# EAGLE design solenoid valve2 (EAGLE 9.2.2)

## Sheet 1 of 5: photorelay0
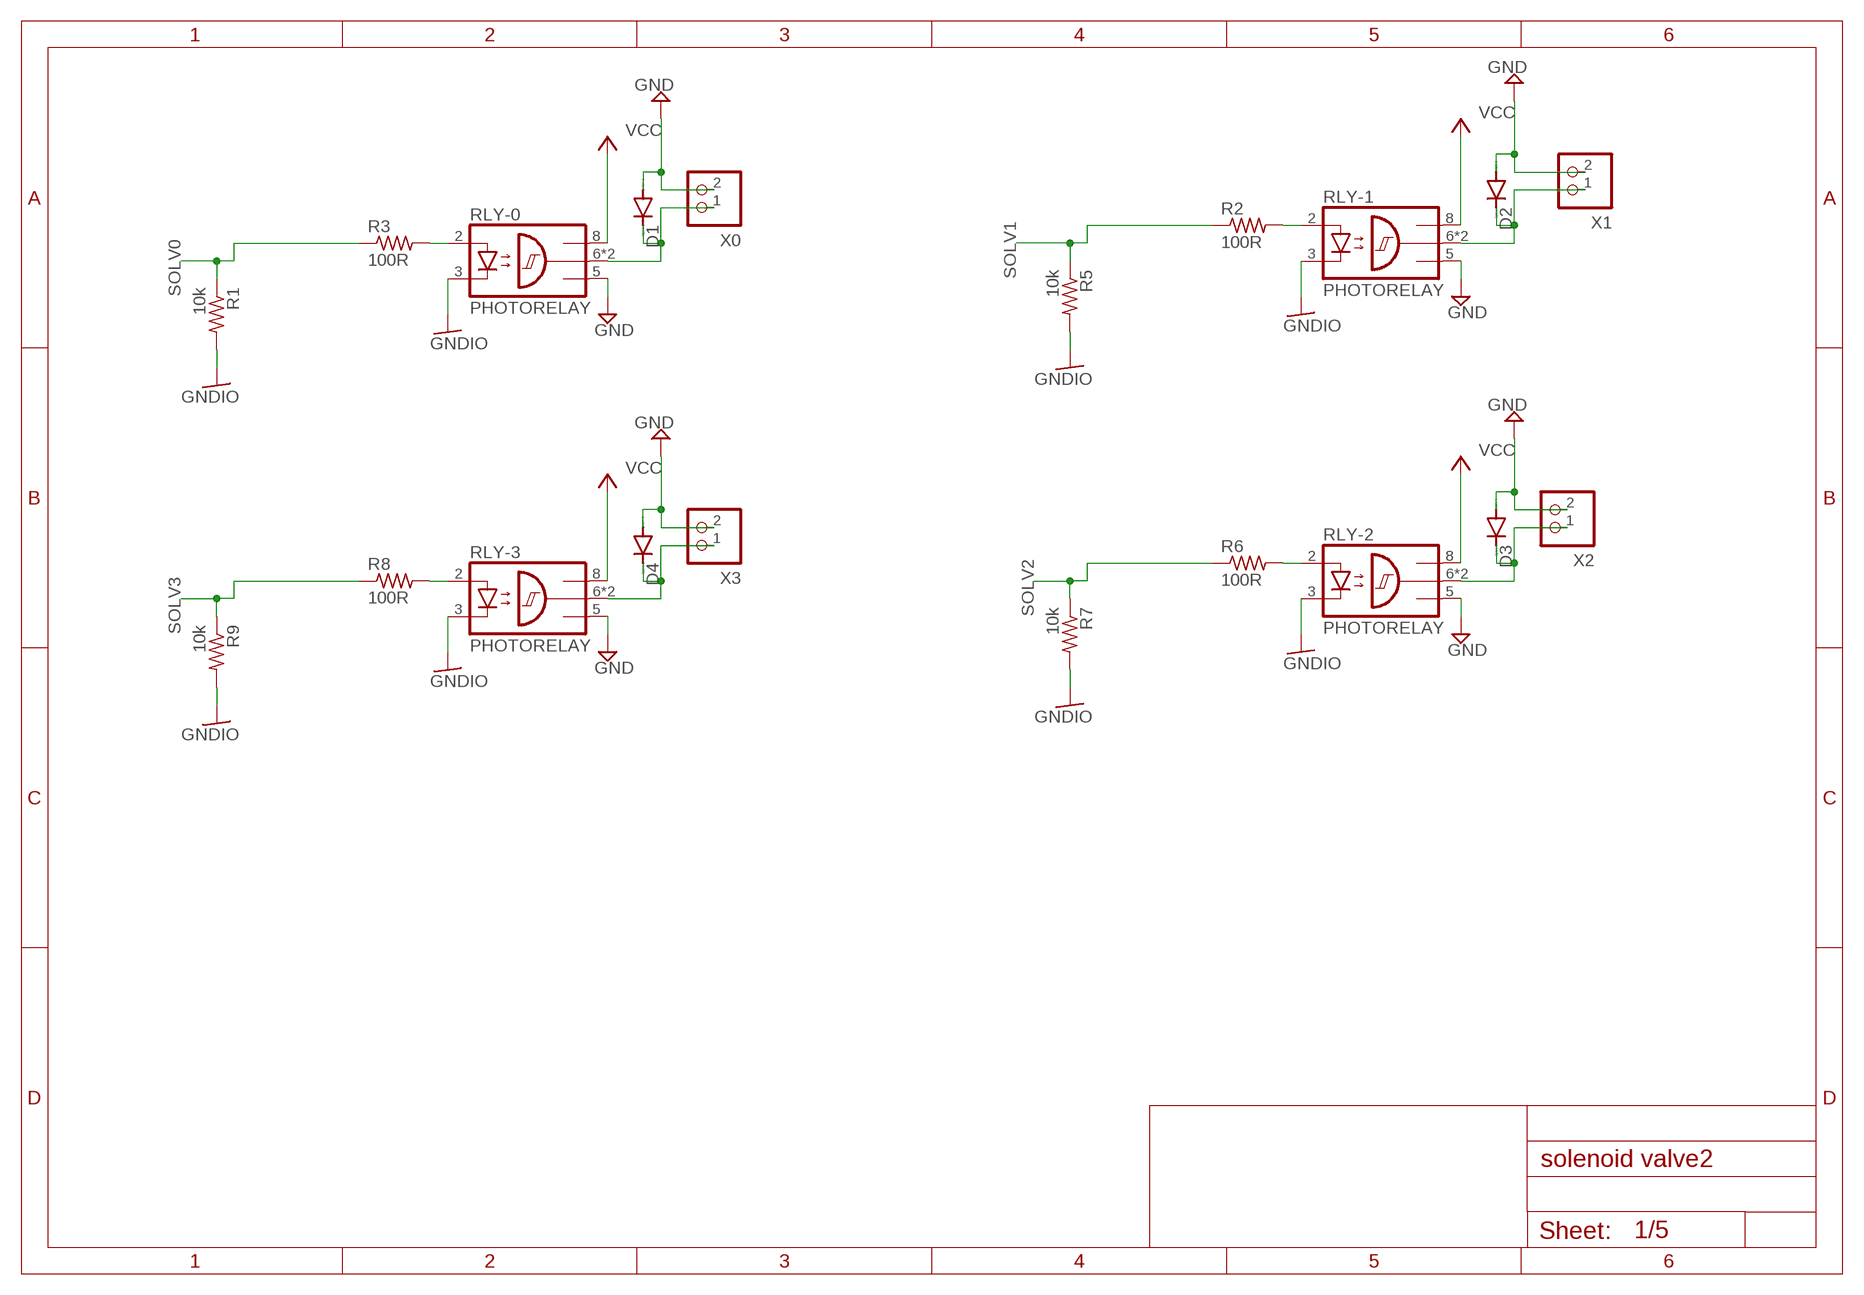
[diagram p0: schematic, sheet 1]

### Parts
D1  DIODE-SOD123  [SOD123]
D2  DIODE-SOD123  [SOD123]
D3  DIODE-SOD123  [SOD123]
D4  DIODE-SOD123  [SOD123]
R1  10k  R-US_R0603  [R0603]
R2  100R  R-US_R0603  [R0603]
R3  100R  R-US_R0603  [R0603]
R5  10k  R-US_R0603  [R0603]
R6  100R  R-US_R0603  [R0603]
R7  10k  R-US_R0603  [R0603]
R8  100R  R-US_R0603  [R0603]
R9  10k  R-US_R0603  [R0603]
RLY-0  PHOTORELAY  [SOP254P1016X385-8]
RLY-1  PHOTORELAY  [SOP254P1016X385-8]
RLY-2  PHOTORELAY  [SOP254P1016X385-8]
RLY-3  PHOTORELAY  [SOP254P1016X385-8]
X0  S2B-XH-A  [S2B-XH-A]
X1  S2B-XH-A  [S2B-XH-A]
X2  S2B-XH-A  [S2B-XH-A]
X3  S2B-XH-A  [S2B-XH-A]

### Nets
GND: D1.A D2.A D3.A D4.A RLY-0.5(GND) RLY-1.5(GND) RLY-2.5(GND) RLY-3.5(GND) X0.2 X1.2 X2.2 X3.2 ; also sheet 2
GNDIO: R1.2 R5.2 R7.2 R9.2 RLY-0.3(C) RLY-1.3(C) RLY-2.3(C) RLY-3.3(C) ; also sheet 2,3,4,5
N$1: D2.C RLY-1.6(OUT) RLY-1.7(OUT) X1.1
N$2: R2.2 RLY-1.2(A)
N$3: D1.C RLY-0.6(OUT) RLY-0.7(OUT) X0.1
N$5: D3.C RLY-2.6(OUT) RLY-2.7(OUT) X2.1
N$6: R3.2 RLY-0.2(A)
N$8: R6.2 RLY-2.2(A)
N$23: D4.C RLY-3.6(OUT) RLY-3.7(OUT) X3.1
N$24: R8.2 RLY-3.2(A)
SOLV0: R1.1 R3.1 ; also sheet 3
SOLV1: R2.1 R5.1 ; also sheet 3
SOLV2: R6.1 R7.1 ; also sheet 3
SOLV3: R8.1 R9.1 ; also sheet 3
VCC: RLY-0.8(VCC) RLY-1.8(VCC) RLY-2.8(VCC) RLY-3.8(VCC) ; also sheet 2

## Sheet 2 of 5: photorelay1
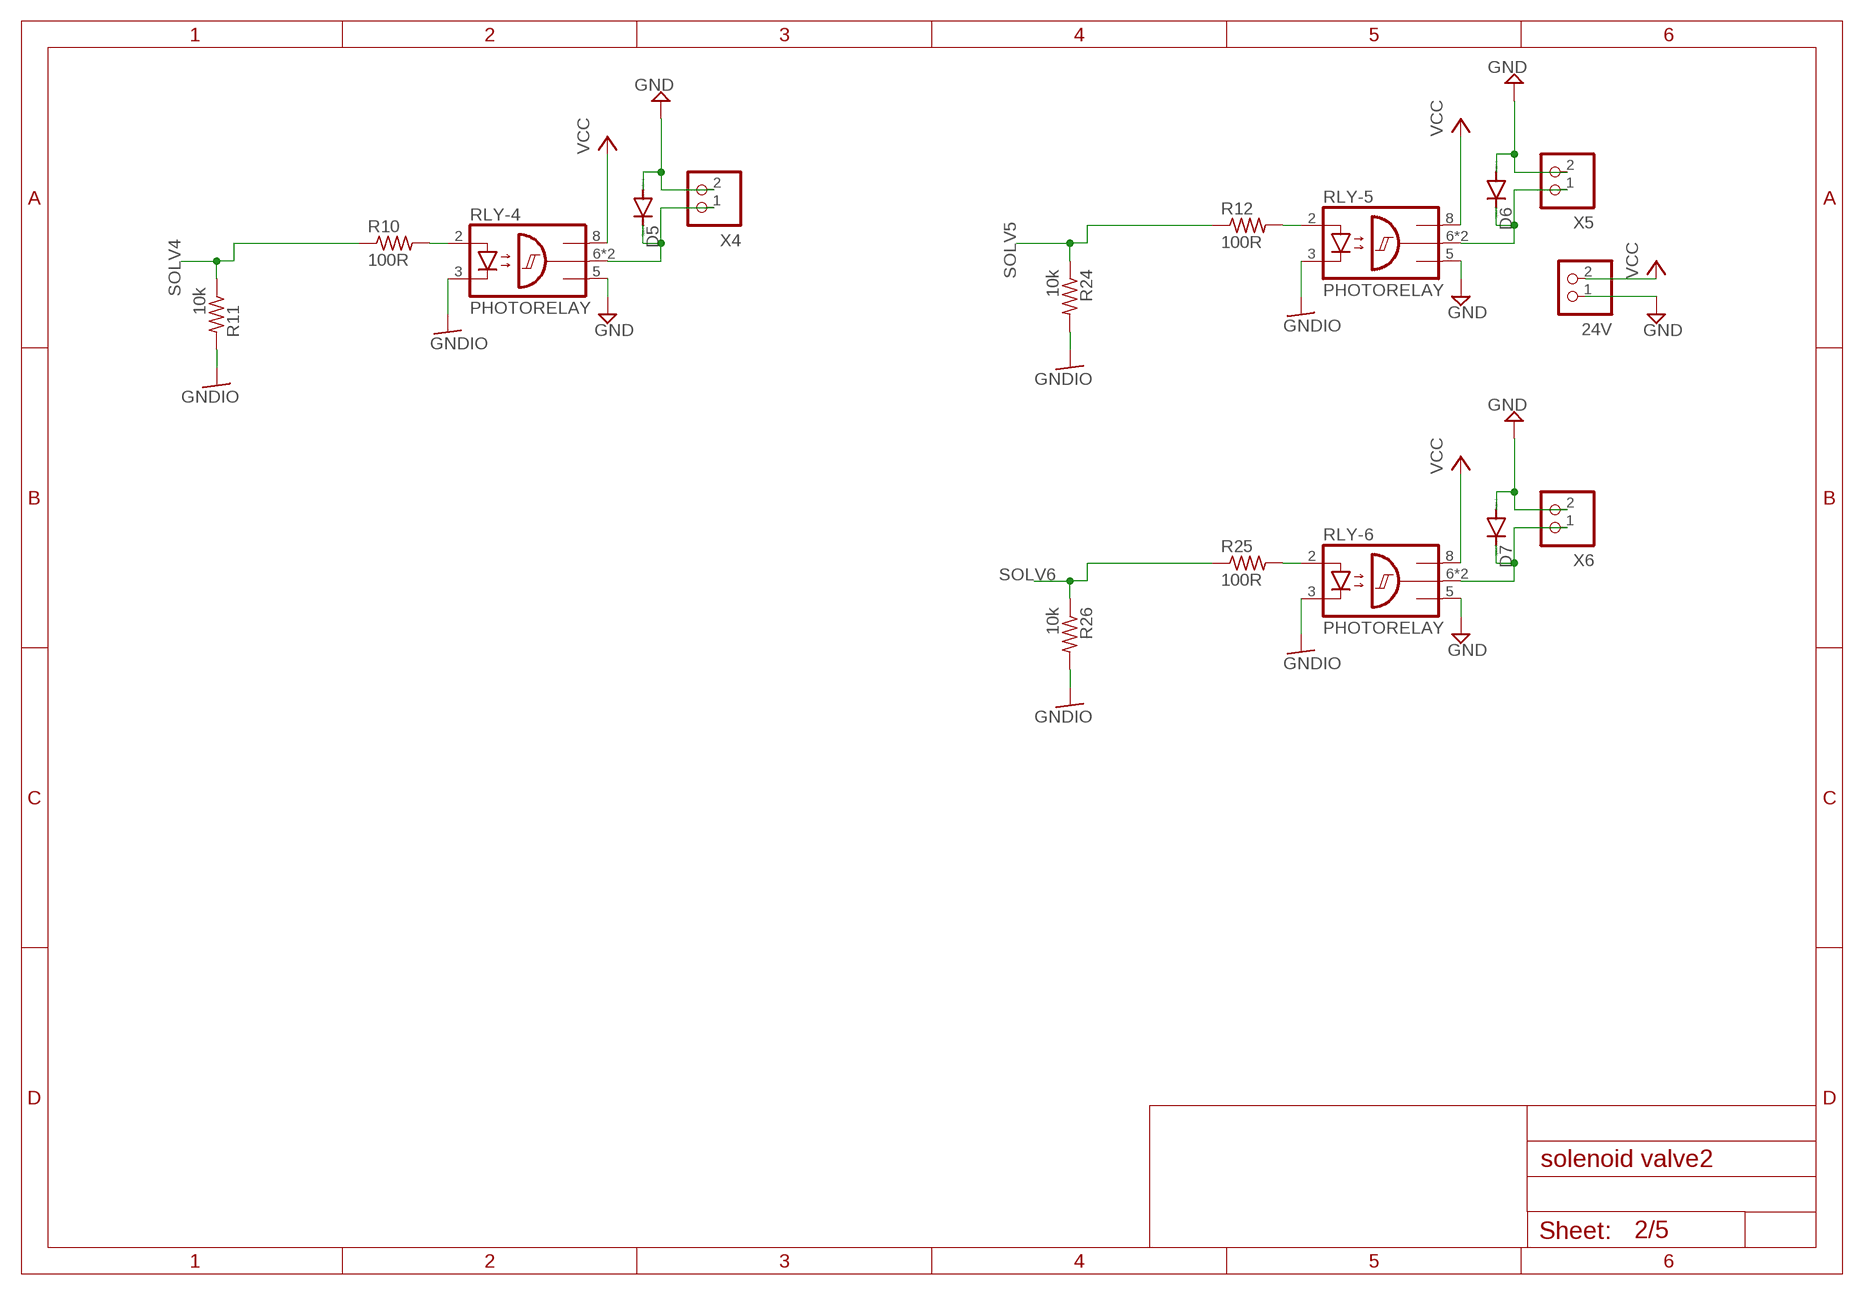
[diagram p1: schematic, sheet 2]

### Parts
24V  S2B-XH-A  [S2B-XH-A]
D5  DIODE-SOD123  [SOD123]
D6  DIODE-SOD123  [SOD123]
D7  DIODE-SOD123  [SOD123]
R10  100R  R-US_R0603  [R0603]
R11  10k  R-US_R0603  [R0603]
R12  100R  R-US_R0603  [R0603]
R24  10k  R-US_R0603  [R0603]
R25  100R  R-US_R0603  [R0603]
R26  10k  R-US_R0603  [R0603]
RLY-4  PHOTORELAY  [SOP254P1016X385-8]
RLY-5  PHOTORELAY  [SOP254P1016X385-8]
RLY-6  PHOTORELAY  [SOP254P1016X385-8]
X4  S2B-XH-A  [S2B-XH-A]
X5  S2B-XH-A  [S2B-XH-A]
X6  S2B-XH-A  [S2B-XH-A]

### Nets
GND: 24V.1 D5.A D6.A D7.A RLY-4.5(GND) RLY-5.5(GND) RLY-6.5(GND) X4.2 X5.2 X6.2 ; also sheet 1
GNDIO: R11.2 R24.2 R26.2 RLY-4.3(C) RLY-5.3(C) RLY-6.3(C) ; also sheet 1,3,4,5
N$26: D5.C RLY-4.6(OUT) RLY-4.7(OUT) X4.1
N$27: R10.2 RLY-4.2(A)
N$29: D6.C RLY-5.6(OUT) RLY-5.7(OUT) X5.1
N$30: R12.2 RLY-5.2(A)
N$32: D7.C RLY-6.6(OUT) RLY-6.7(OUT) X6.1
N$33: R25.2 RLY-6.2(A)
SOLV4: R10.1 R11.1 ; also sheet 3
SOLV5: R12.1 R24.1 ; also sheet 3
SOLV6: R25.1 R26.1 ; also sheet 3
VCC: 24V.2 RLY-4.8(VCC) RLY-5.8(VCC) RLY-6.8(VCC) ; also sheet 1

## Sheet 3 of 5: mcu
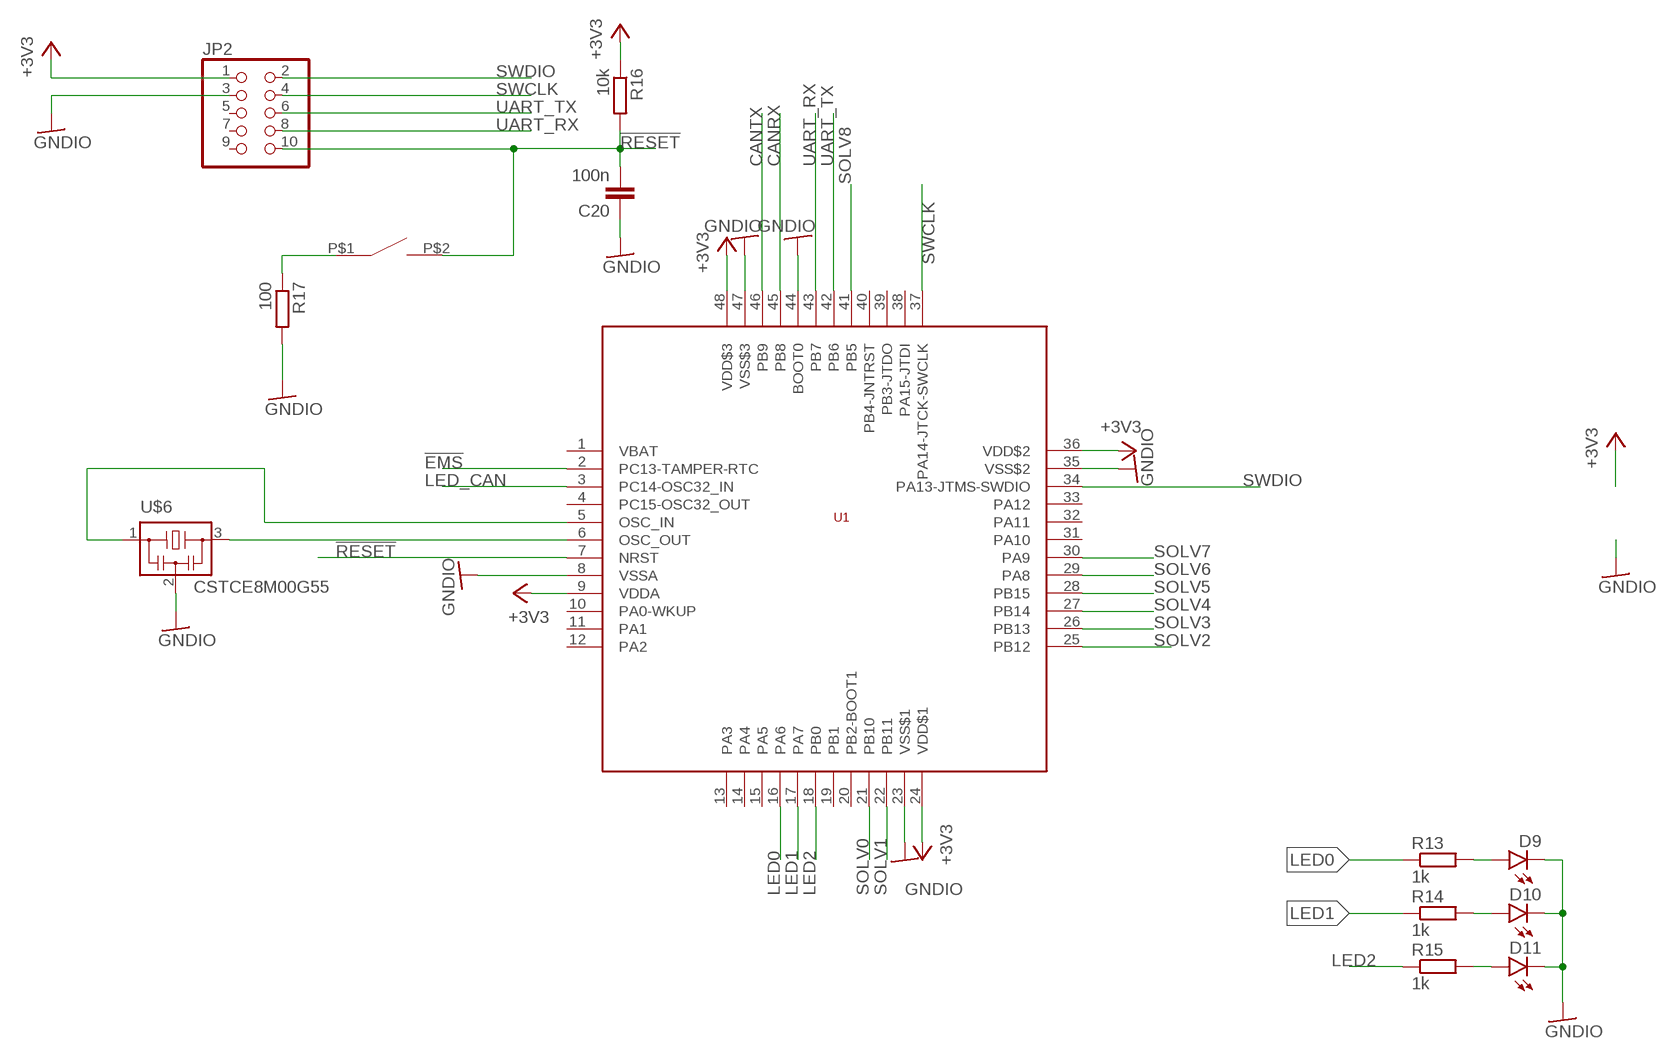
[diagram p2: schematic, sheet 3]

### Parts
C20  100n  C-EUC0603  [C0603]
D9  LEDCHIPLED_0805  [CHIPLED_0805]
D10  LEDCHIPLED_0805  [CHIPLED_0805]
D11  LEDCHIPLED_0805  [CHIPLED_0805]
JP2  PINHD-2X5/90  [2X05/90]
R13  1k  R-EU_R0603  [R0603]
R14  1k  R-EU_R0603  [R0603]
R15  1k  R-EU_R0603  [R0603]
R16  10k  R-EU_R0603  [R0603]
R17  100  R-EU_R0603  [R0603]
SW1  SWITCH_TACTILETOP  [SWITCH_TACTILE_3X6]
U1  STM32F103C8  [LQFP48]
U$6  CSTCE8M00G55  [CSTCE8M00G55]

### Nets
!EMS: U1.2(PC13-TAMPER-RTC) ; also sheet 4
!RESET: C20.2 JP2.10 R16.2 SW1.P$2 U1.7(NRST)
+3V3: JP2.1 R16.1 U1.9(VDDA) U1.24(VDD$1) U1.36(VDD$2) U1.48(VDD$3) ; also sheet 5
CANRX: U1.45(PB8) ; also sheet 4
CANTX: U1.46(PB9) ; also sheet 4
GNDIO: C20.1 D9.C D10.C D11.C JP2.3 R17.2 U1.8(VSSA) U1.23(VSS$1) U1.35(VSS$2) U1.44(BOOT0) U1.47(VSS$3) U$6.2 ; also sheet 1,2,4,5
LED0: R13.1 U1.16(PA6)
LED1: R14.1 U1.17(PA7)
LED2: R15.1 U1.18(PB0)
LED_CAN: U1.3(PC14-OSC32_IN) ; also sheet 4
N$9: D10.A R14.2
N$10: D9.A R13.2
N$11: U1.6(OSC_OUT) U$6.3
N$16: R17.1 SW1.P$1
N$19: U1.5(OSC_IN) U$6.1
N$21: D11.A R15.2
SOLV0: U1.21(PB10) ; also sheet 1
SOLV1: U1.22(PB11) ; also sheet 1
SOLV2: U1.25(PB12) ; also sheet 1
SOLV3: U1.26(PB13) ; also sheet 1
SOLV4: U1.27(PB14) ; also sheet 2
SOLV5: U1.28(PB15) ; also sheet 2
SOLV6: U1.29(PA8) ; also sheet 2
SOLV7: U1.30(PA9)
SOLV8: U1.41(PB5)
SWCLK: JP2.4 U1.37(PA14-JTCK-SWCLK)
SWDIO: JP2.2 U1.34(PA13-JTMS-SWDIO)
UART_RX: JP2.8 U1.43(PB7)
UART_TX: JP2.6 U1.42(PB6)
Unconnected: JP2.5 JP2.7 JP2.9 U1.1(VBAT) U1.4(PC15-OSC32_OUT) U1.10(PA0-WKUP) U1.11(PA1) U1.12(PA2) U1.13(PA3) U1.14(PA4) U1.15(PA5) U1.19(PB1) U1.20(PB2-BOOT1) U1.31(PA10) U1.32(PA11) U1.33(PA12) U1.38(PA15-JTDI) U1.39(PB3-JTDO) U1.40(PB4-JNTRST)

## Sheet 4 of 5: can
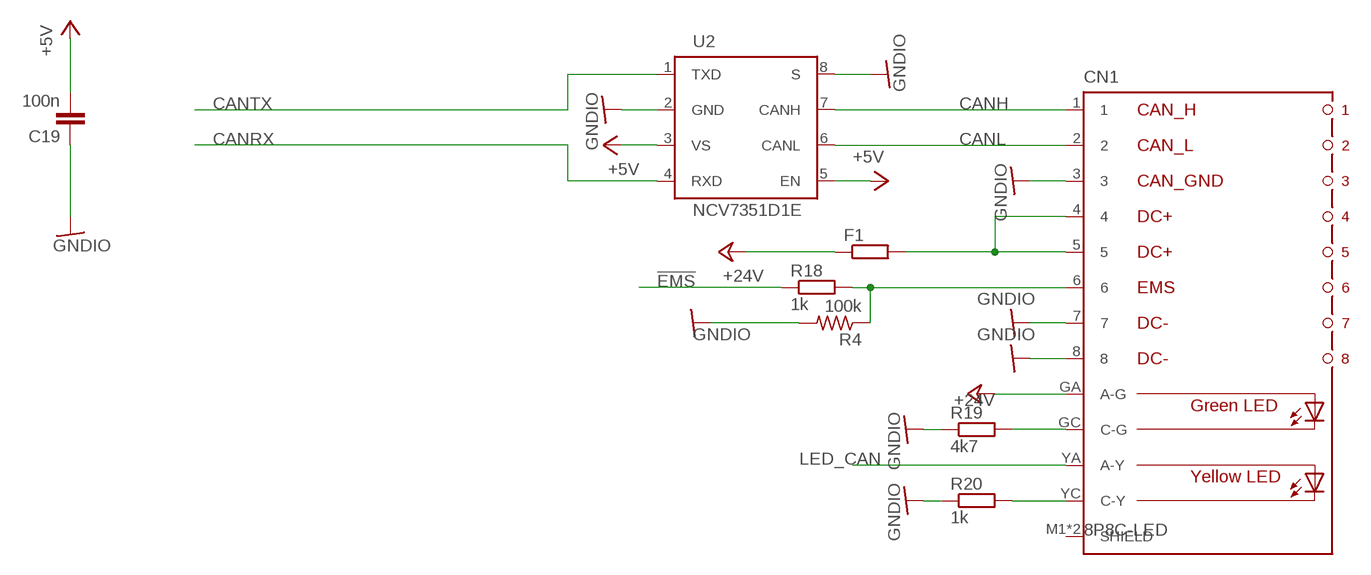
[diagram p3: schematic, sheet 4]

### Parts
C19  100n  C-EUC0603  [C0603]
CN1  8P8C-LED  [8P8C-LED]
F1  R-EU_R1206  [R1206]
R4  100k  R-US_R0603  [R0603]
R18  1k  R-EU_R0603  [R0603]
R19  4k7  R-EU_R0603  [R0603]
R20  1k  R-EU_R0603  [R0603]
U2  NCV7351D1E  [SO08]

### Nets
!EMS: R18.1 ; also sheet 3
+5V: C19.2 U2.3(VS) U2.5(EN) ; also sheet 5
+24V: CN1.GA(A-G) F1.1 ; also sheet 5
CANH: CN1.1 U2.7(CANH)
CANL: CN1.2 U2.6(CANL)
CANRX: U2.4(RXD) ; also sheet 3
CANTX: U2.1(TXD) ; also sheet 3
GNDIO: C19.1 CN1.3 CN1.7 CN1.8 R4.2 R19.1 R20.1 U2.2(GND) U2.8(S) ; also sheet 1,2,3,5
LED_CAN: CN1.YA(A-Y) ; also sheet 3
N$12: CN1.4 CN1.5 F1.2
N$18: CN1.YC(C-Y) R20.2
N$22: CN1.GC(C-G) R19.2
N$38: CN1.6 R4.1 R18.2
Unconnected: CN1.M1(SHIELD) CN1.M2(SHIELD)

## Sheet 5 of 5: power suply
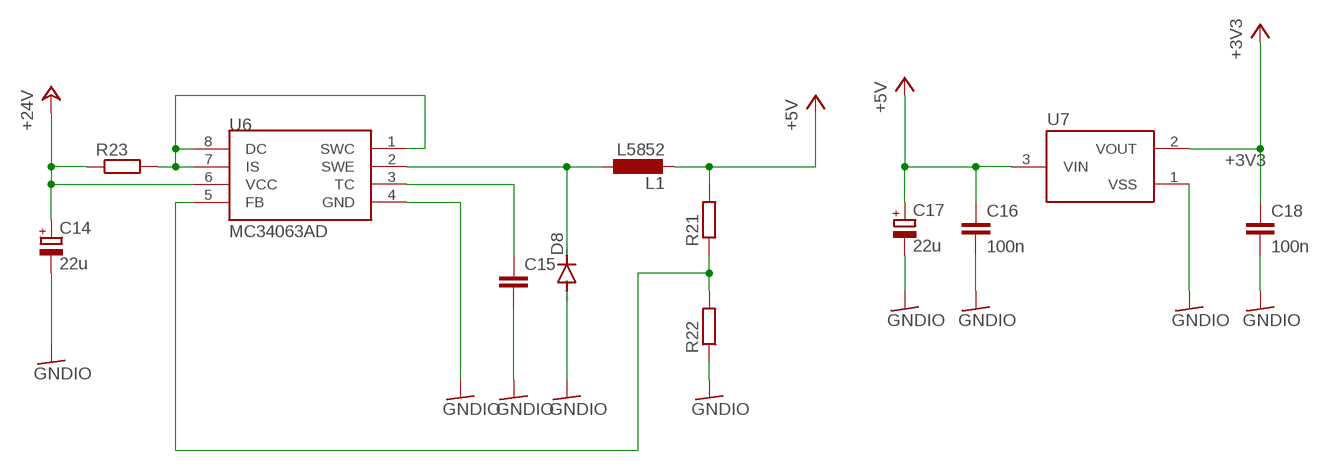
[diagram p4: schematic, sheet 5]

### Parts
C14  22u  CPOL-EUE2-5  [E2-5]
C15  C-EUC0603  [C0603]
C16  100n  C-EUC0603  [C0603]
C17  22u  CPOL-EUE2-5  [E2-5]
C18  100n  C-EUC0603  [C0603]
D8  DIODE-SOD123  [SOD123]
L1  L5852  [L5852]
R21  R-EU_R0603  [R0603]
R22  R-EU_R0603  [R0603]
R23  R-EU_R1206  [R1206]
U6  MC34063AD  [SOIC8]
U7  XC6206  [SOT95P240X110-3]

### Nets
+3V3: C18.1 U7.2(VOUT) ; also sheet 3
+5V: C16.1 C17.+ L1.P$2 R21.2 U7.3(VIN) ; also sheet 4
+24V: C14.+ R23.1 U6.6(VCC) ; also sheet 4
GNDIO: C14.- C15.2 C16.2 C17.- C18.2 D8.A R22.1 U6.4(GND) U7.1(VSS) ; also sheet 1,2,3,4
N$13: R23.2 U6.1(SWC) U6.7(IS) U6.8(DC)
N$14: D8.C L1.P$1 U6.2(SWE)
N$15: C15.1 U6.3(TC)
N$17: R21.1 R22.2 U6.5(FB)

## Library data of the parts
24V X0 X1-X6 = jst-xh:S2B-XH-A: Wire-to-Board 2.5mm pitch side mount connector Source: http://www.jst-mfg.com/product/pdf/jpn/XH.pdf http://www.jst-mfg.com/product/detail.php?series=277
C14 C17 = rcl:CPOL-EU: POLARIZED CAPACITOR, European symbol
C15 = rcl:C-EU: CAPACITOR, European symbol; SPICEPREFIX: C
C16 C18-C20 = rcl:C-EU: CAPACITOR, European symbol
CN1 = con-rj45:8P8C-LED: generic 8P8C connector with two LED's; OC_FARNELL: unknown; OC_NEWARK: unknown
D1-D8 = diode:DIODE-: DIODE
D9-D11 = led:LED: LED OSRAM: - CHIPLED LG R971, LG N971, LY N971, LG Q971, LY Q971, LO R971, LY R971 LH N974, LH R974 LS Q976, LO Q976, LY Q976 LO Q996 - Hyper CHIPLED LW Q18S LB Q993, LB Q99A, LB R99A - SideLED LS A670, LO A670, LY A670, LG A670, LP A670 LB A673, LV A673, LT A673, LW A673 LH A674 LY A675 LS A676, LA A676, LO A676, LY A676, LW A676 LS A679, LY A679, LG A679 - Hyper Micro SIDELED® LS Y876, LA Y876, LO Y876, LY Y876 LT Y87S - SmartLED LW L88C, LW L88S LB L89C, LB L89S, LG L890 LS L89K, LO L89K, LY L89K LS L896, LA L896, LO L896, LY L896 - TOPLED LS T670, LO T670, LY T670, LG T670, LP T670 LSG T670, LSP T670, LSY T670, LOP T670, LYG T670 LG T671, LOG T671, LSG T671 LB T673, LV T673, LT T673, LW T673 LH T674 LS T676, LA T676, LO T676, LY T676, LB T676, LH T676, LSB T676, LW T676 LB T67C, LV T67C, LT T67C, LS T67K, LO T67K, LY T67K, LW E67C LS E67B, LA E67B, LO E67B, LY E67B, LB E67C, LV E67C, LT E67C LW T67C LS T679, LY T679, LG T679 LS T770, LO T770, LY T770, LG T770, LP T770 LB T773, LV T773, LT T773, LW T773 LH T774 LS E675, LA E675, LY E675, LS T675 LS T776, LA T776, LO T776, LY T776, LB T776 LHGB T686 LT T68C, LB T68C - Hyper Mini TOPLED® LB M676 - Mini TOPLED Santana® LG M470 LS M47K, LO M47K, LY M47K Source: http://www.osram.convergy.de LUXEON: - LUMILED® LXK2-PW12-R00, LXK2-PW12-S00, LXK2-PW14-U00, LXK2-PW14-V00 LXK2-PM12-R00, LXK2-PM12-S00, LXK2-PM14-U00 LXK2-PE12-Q00, LXK2-PE12-R00, LXK2-PE12-S00, LXK2-PE14-T00, LXK2-PE14-U00 LXK2-PB12-K00, LXK2-PB12-L00, LXK2-PB12-M00, LXK2-PB14-N00, LXK2-PB14-P00, LXK2-PB14-Q00 LXK2-PR12-L00, LXK2-PR12-M00, LXK2-PR14-Q00, LXK2-PR14-R00 LXK2-PD12-Q00, LXK2-PD12-R00, LXK2-PD12-S00 LXK2-PH12-R00, LXK2-PH12-S00 LXK2-PL12-P00, LXK2-PL12-Q00, LXK2-PL12-R00 Source: www.luxeon.com KINGBRIGHT: KA-3528ASYC Source: www.kingbright.com
F1 R18-R23 = rcl:R-EU_: RESISTOR, European symbol; SPICEPREFIX: R
JP2 = pinhead:PINHD-2X5: PIN HEADER
L1 = l_ysk:L5852
R1-R12 R24-R26 = rcl:R-US_: RESISTOR, American symbol; SPICEPREFIX: R
R13-R17 = rcl:R-EU_: RESISTOR, European symbol
RLY-0 RLY-1-RLY-6 = opto-coupler:PHOTORELAY
SW1 = switch-tactile:SWITCH_TACTILE
U1 = stm32_mcu:STM32F103C8: STMicroelectronics STM32F103C8 Mainstream Performance line, ARM Cortex-M3 MCU with 64 Kbytes Flash, 72 MHz CPU, motor control, USB and CAN references: datasheet <https://www.st.com/resource/en/datasheet/stm32f103c8.pdf> product page <https://www.st.com/ja/microcontrollers/stm32f103c8.html>
U2 = on-semi:NCV7351D1E: High Speed CAN Transceiver Source: NCV7351-D.PDF <http://www.onsemi.com/PowerSolutions/document/NCV7351-D.PDF>
U6 = mc34063:MC34063
U7 = torex:XC6206
U$6 = resonator:CSTCE8M00G55

## Board
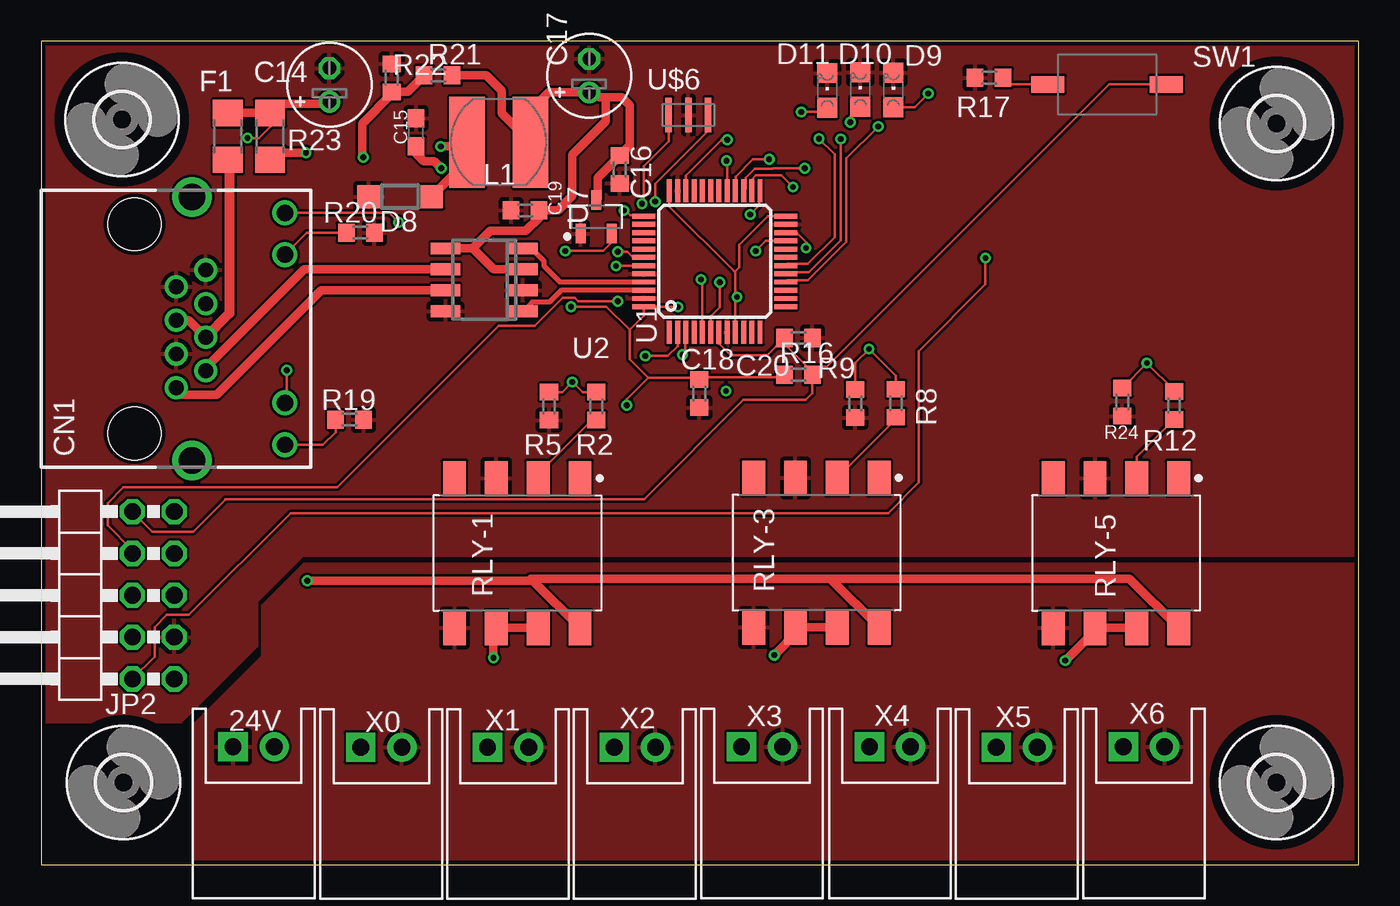
[diagram p5: board, top side]
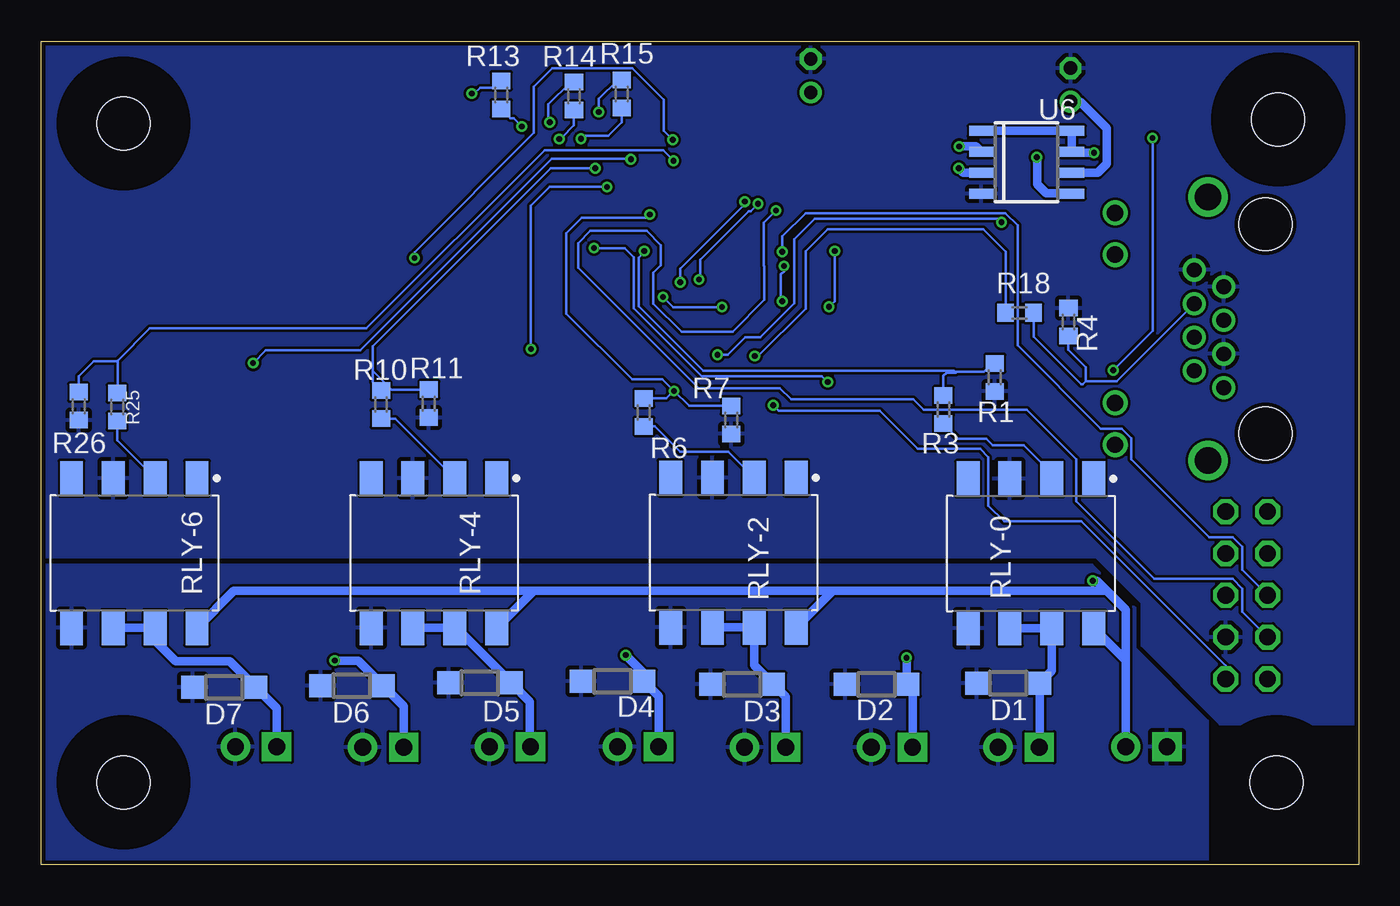
[diagram p6: board, bottom side, seen from below]

Size 80 x 50 mm. Coordinates in mm from the lower left corner, seen from the top.
Outline: 0,0 80,0 80,50 0,50 0,0
Copper layers (1*16): Top 0.035mm / dielectric 1.5mm / Bottom 0.035mm
Design rules "SeeedStudio_2layer_DRU_no_angle_20140221": minimum track width 6mil, minimum drill 12mil, track to track 6mil, track to pad 6mil, pad to pad 6mil, via to via 6mil, smd to smd 0mil, copper to edge 10mil, drill to drill 10mil, minimum pad ring 10mil, minimum via ring 6mil, stop-mask expansion 2mil, vias tented up to drill 100mil, thermal gap 10mil

### Footprints (pad centres in the part's own frame; a part is rotated, then mirrored left to right if it is on the bottom)
S2B-XH-A = drill 1.016 pad 1.778 square: 1 1.25,0 | drill 1.016 pad 1.778: 2 -1.25,0
E2-5 = drill 0.813 pad 1.27: + -1.016,0 | drill 0.813 pad 1.27 octagon: - 1.016,0
C0603 = smd 1.1 x 1: 1 -0.85,0; 2 0.85,0
C0603' = smd 1 x 1.1: 1 -0.85,0; 2 0.85,0
8P8C-LED = drill 0.9 pad 1.3: 1 3.57,-3.81; 2 2.55,-2.03; 3 1.53,-3.81; 4 0.51,-2.03; 5 -0.51,-3.81; 6 -1.53,-2.03; 7 -2.55,-3.81; 8 -3.57,-2.03 | drill 1 pad 1.422: GA 4.5,2.78; GC 7.04,2.78; YA -7.04,2.78; YC -4.5,2.78 | drill 1.6 pad 2.184: M1 -8,-2.85; M2 8,-2.85 | hole 3.2: 6.35,-6.35; -6.35,-6.35
SOD123 = smd 1.4 x 1.4: A 1.9,0; C -1.9,0
CHIPLED_0805 = smd 1.2 x 1.2: A 0,-1.05; C 0,1.05
R1206 = smd 1.6 x 1.803: 1 -1.422,0; 2 1.422,0
2X05/90 = drill 1.016 octagon: 1 -5.08,-6.35; 2 -5.08,-3.81; 3 -2.54,-6.35; 4 -2.54,-3.81; 5 0,-6.35; 6 0,-3.81; 7 2.54,-6.35; 8 2.54,-3.81; 9 5.08,-6.35; 10 5.08,-3.81
L5852 = smd 2.15 x 5.5: P$1 1.925,0; P$2 -1.925,0
R0603 = smd 1 x 1.1: 1 -0.85,0; 2 0.85,0
SOP254P1016X385-8 = smd 2.09 x 1.389: 1 -4.54,3.81; 2 -4.54,1.27; 3 -4.54,-1.27; 4 -4.54,-3.81; 5 4.54,-3.81; 6 4.54,-1.27; 7 4.54,1.27; 8 4.54,3.81
SWITCH_TACTILE_3X6 = smd 2 x 1: P$1 -3.6,0; P$2 3.6,0
LQFP48 = smd 1.4 x 0.3: 1 -4.3,2.75; 2 -4.3,2.25; 3 -4.3,1.75; 4 -4.3,1.25; 5 -4.3,0.75; 6 -4.3,0.25; 7 -4.3,-0.25; 8 -4.3,-0.75; 9 -4.3,-1.25; 10 -4.3,-1.75; 11 -4.3,-2.25; 12 -4.3,-2.75; 25 4.3,-2.75; 26 4.3,-2.25; 27 4.3,-1.75; 28 4.3,-1.25; 29 4.3,-0.75; 30 4.3,-0.25; 31 4.3,0.25; 32 4.3,0.75; 33 4.3,1.25; 34 4.3,1.75; 35 4.3,2.25; 36 4.3,2.75 | smd 0.3 x 1.4: 13 -2.75,-4.3; 14 -2.25,-4.3; 15 -1.75,-4.3; 16 -1.25,-4.3; 17 -0.75,-4.3; 18 -0.25,-4.3; 19 0.25,-4.3; 20 0.75,-4.3; 21 1.25,-4.3; 22 1.75,-4.3; 23 2.25,-4.3; 24 2.75,-4.3; 37 2.75,4.3; 38 2.25,4.3; 39 1.75,4.3; 40 1.25,4.3; 41 0.75,4.3; 42 0.25,4.3; 43 -0.25,4.3; 44 -0.75,4.3; 45 -1.25,4.3; 46 -1.75,4.3; 47 -2.25,4.3; 48 -2.75,4.3
SO08 = smd 0.72 x 1.78: 1 -1.905,-2.35; 2 -0.635,-2.35; 3 0.635,-2.35; 4 1.905,-2.35; 5 1.905,2.35; 6 0.635,2.35; 7 -0.635,2.35; 8 -1.905,2.35
SOIC8 = smd 0.6 x 1.5: 1 -1.905,-2.75; 2 -0.635,-2.75; 3 0.635,-2.75; 4 1.905,-2.75; 5 1.905,2.75; 6 0.635,2.75; 7 -0.635,2.75; 8 -1.905,2.75
SOT95P240X110-3 = smd 1.18 x 0.609: 1 -1.024,0.95; 2 -1.024,-0.95; 3 1.024,0
3,2 = hole 3.2: 0,0
CSTCE8M00G55 = smd 0.4 x 2.1: 1 -1.2,0; 2 0,0; 3 1.2,0

### Placement (x,y rotation side)
24V  12.9,7.16 180 top
C14  17.5,47.35 90 top
C15  22.76,44.48 90 top
C16  100n  [C0603']  35.13,42.21 270 top
C17  33.27,47.9 90 top
C18  100n  [C0603']  39.95,28.6 270 top
C19  100n  [C0603']  29.39,39.73 0 top
C20  100n  [C0603']  45.97,31.98 180 top
CN1  12.01,32.54 270 top
D1  21.29,11.02 180 bottom
D2  29.29,10.95 180 bottom
D3  37.44,10.95 180 bottom
D4  45.31,11.13 180 bottom
D5  53.37,11.05 180 bottom
D6  61.14,10.87 180 bottom
D7  68.88,10.77 180 bottom
D8  21.79,40.56 180 top
D9  51.74,47.04 0 top
D10  49.73,47.07 0 top
D11  47.73,47.02 0 top
F1  11.33,44.22 270 top
JP2  1.73,16.36 90 top
L1  27.79,43.87 180 top
R1  22.1,29.59 270 bottom
R2  33.71,27.84 270 top
R3  25.22,27.64 270 bottom
R4  17.63,32.94 90 bottom
R5  30.84,27.84 270 top
R6  43.41,27.46 270 bottom
R7  38.1,27 270 bottom
R8  51.89,28.02 270 top
R9  49.43,27.99 270 top
R10  59.36,27.94 270 bottom
R11  56.46,27.99 270 bottom
R12  68.78,27.89 270 top
R13  52.07,46.74 90 bottom
R14  47.65,46.66 90 bottom
R15  44.75,46.79 90 bottom
R16  45.97,29.74 0 top
R17  57.56,47.78 180 top
R18  20.6,33.5 0 bottom
R19  18.72,27.03 180 top
R20  19.38,38.38 180 top
R21  24.1,47.93 0 top
R22  21.29,47.78 270 top
R23  13.89,44.22 270 top
R24  65.63,28.09 270 top
R25  75.39,27.79 270 bottom
R26  77.72,27.84 270 bottom
RLY-0  19.91,18.9 270 bottom
RLY-1  28.91,18.92 270 top
RLY-2  37.97,18.95 270 bottom
RLY-3  47.07,18.95 270 top
RLY-4  56.16,18.92 270 bottom
RLY-5  65.25,18.92 270 top
RLY-6  74.35,18.92 270 bottom
SW1  64.72,47.37 0 top
U1  40.89,36.63 90 top
U2  26.9,35.51 90 top
U6  20.17,42.65 270 bottom
U7  33.71,39.34 90 top
U$1  [3,2]  5,5 0 top
U$2  [3,2]  4.9,45.24 0 top
U$3  [3,2]  75,45 0 top
U$4  [3,2]  75,5 0 top
U$6  39.29,45.52 0 top
X0  20.65,7.14 180 top
X1  28.35,7.14 180 top
X2  36.04,7.14 180 top
X3  43.76,7.16 180 top
X4  51.54,7.16 180 top
X5  59.23,7.14 180 top
X6  66.95,7.16 180 top

### Tracks (layer width: path | path; a pad name or v marks a point on that pad's centre or on a via)
!EMS  (via drill 0.35)
  Top 0.152: v36.68,30.89 38.05,30.89 38.64,31.48 U1.2
  Bottom 0.152: v36.68,30.89 36.45,30.89 33.58,33.76 33.58,37.24 32.25,38.57 22.81,38.57 21.45,37.21 R18.1
!RESET
  Top 0.152: U1.7 41.14,31.64 41.16,31.64 41.86,30.94 44.08,30.94 C20.2 45.12,31.62 46.52,30.23 | 46.52,30.23 46.82,29.92 R16.2 46.82,28.63 46.42,28.22 42.63,28.22 36.6,22.19 11.18,22.19 11.18,22.15 9.25,20.22 6.76,20.22 JP2.10 | 46.52,30.23 47.69,30.23 64.83,47.37 SW1.P$2
+3V3  (via drill 0.35)
  Top 0.152: U1.36 38.14,39.95 42.08,36.02 42.14,36.02 | v38.66,33.86 38.64,33.88 U1.48 36.59,33.34 35.73,32.47 | v31.83,37.26 34.11,37.26 34.66,37.8 U7.2 | R16.1 44.97,29.59 40.09,29.59 C18.1 39.84,29.57 36.85,29.57 | v32.17,33.88 34.32,33.88 35.73,32.47 | 42.14,36.02 42.14,34.57 v42.24,34.47 42.14,34.37 U1.9 | 42.14,36.02 42.39,36.27 42.39,37.64 44.13,39.38 U1.24 | 36.85,29.57 35.73,30.7 35.73,32.47 | v35.56,27.89 35.56,28.27 36.85,29.57
  Bottom 0.152: v38.66,33.86 41.63,33.86 v42.24,34.47 | v31.83,37.26 31.83,34.22 v32.17,33.88 | JP2.1 8.08,12.06 16.86,20.84 21.54,20.84 22.49,21.79 22.49,24.74 22.99,25.24 26.78,25.24 29.1,27.56 35.23,27.56 v35.56,27.89
+5V
  Top 0.508: R21.2 27.04,47.93 27.96,47 27.96,45.61 L1.P$2 29.71,45.79 30.81,46.89 C17.+ 33.58,46.89 33.87,46.6 34.29,46.6 | U7.3 33.78,40.45 33.78,41.69 35.13,43.04 C16.1 35.74,43.67 35.74,46.1 35.24,46.6 34.29,46.6 | 26.2,37.41 27.47,36.14 U2.3 | 34.29,46.6 34.29,45.14 32.26,43.1 32.26,40.6 31.38,39.73 C19.2 30.24,39.29 29.43,38.48 27.27,38.48 26.2,37.41 | U2.5 26.2,37.41
+24V  (via drill 0.35)
  Top 0.152: R23.1 13.89,44.81 13.21,44.12 v12.52,44.12 | v14.91,30.02 14.91,28.15 CN1.GA
  Top 0.508: F1.1 R23.1 14.45,46.2 17.37,46.2 C14.+
  Bottom 0.152: v12.52,44.12 12.52,32.41 v14.91,30.02
  Bottom 0.508: U6.6 15.84,42.01 15.3,42.56 15.3,44.71 16.92,46.33 C14.+
CANH
  Top 0.508: U2.7 17,34.87 10.67,28.55 8.62,28.55 CN1.1
CANL
  Top 0.508: CN1.2 9.98,30.17 15.96,36.14 U2.6
CANRX
  Top 0.305: U1.45 31.5,35.38 30.53,36.35 30.53,36.65 29.76,37.41 U2.4
CANTX
  Top 0.305: U1.46 31.56,34.88 30.85,34.16 29.81,34.16 U2.1
GND
  pour Top: 9.22,-1.47 9.22,8.48 13.44,12.7 13.44,15.75 15.95,18.26 80.16,18.26 80.16,-0.1 10.59,-0.1
  pour Bottom: 9.17,-0.2 9.17,8.74 13.59,13.16 13.59,15.61 16.2,18.21 80.06,18.21 80.06,-0.33 79.91,-0.48 9.45,-0.48
GNDIO
  pour Top: 0,50.04 0,8.71 0.05,8.66 8.51,8.66 10.26,10.41 13.11,13.26 13.11,15.98 15.9,18.77 80.06,18.77 80.06,49.91 79.88,50.09 0.05,50.09
  pour Bottom: 0,49.89 0,8.61 0.03,8.59 0.08,8.53 8.43,8.53 13.18,13.28 13.18,15.88 15.98,18.67 79.81,18.67 80.01,18.87 80.01,50.04 0.15,50.04
LED0  (via drill 0.35)
  Top 0.152: v50.81,44.82 48.88,42.89 48.88,37.81 46.55,35.47 45.29,35.47 U1.16
  Bottom 0.152: R13.1 51.51,45.33 51.32,45.33 v50.81,44.82
LED1  (via drill 0.35)
  Top 0.152: U1.17 45.29,35.97 46.6,35.97 48.54,37.92 v48.54,44.06
  Bottom 0.152: R14.1 47.65,44.9 48.41,44.14 48.47,44.14 v48.54,44.06
LED2  (via drill 0.35)
  Top 0.152: U1.18 45.29,36.47 46.55,36.47 48.18,38.1 48.18,43.12 v47.22,44.08
  Bottom 0.152: R15.1 44.76,45.07 45.57,44.26 47.04,44.26 v47.22,44.08
LED_CAN  (via drill 0.35)
  Top 0.152: CN1.YA 21.13,39.58 v21.69,39.01 | v38.94,30.96 39.12,31.14 39.12,32.3 U1.3
  Bottom 0.152: v38.94,30.96 38.33,30.96 37.26,32.03 36.35,32.03 34.29,34.09 34.29,37.98 33.05,39.22 21.89,39.22 v21.69,39.01
N$1  (via drill 0.35)
  Top 0.508: v27.46,12.57 27.46,14.21 RLY-1.6 RLY-1.7
  Bottom 0.508: X1.1 27.1,10.66 D2.C 27.46,11.02 v27.46,12.57
N$2
  Top 0.152: R2.2 33.43,26.99 30.18,23.74 RLY-1.2
N$3
  Bottom 0.508: X0.1 19.39,7.15 D1.C 18.64,11.77 RLY-0.7 RLY-0.6
N$5
  Bottom 0.508: X2.1 34.79,10.2 D3.C 36.7,12.11 RLY-2.7 RLY-2.6
N$6
  Bottom 0.152: R3.2 24.31,25.87 22.63,25.87 22.23,25.47 20.34,25.47 18.64,23.77 RLY-0.2
N$8
  Bottom 0.152: R6.2 42.75,26.61 41.2,25.06 38.28,25.06 RLY-2.2
N$9  (via drill 0.35)
  Top 0.152: D10.A 49.12,45.41 v49.12,45.07
  Bottom 0.152: R14.2 47.85,47.51 49.2,46.16 49.2,45.15 v49.12,45.07
N$10  (via drill 0.35)
  Top 0.152: D9.A 53.04,45.99 53.85,46.8 v53.85,46.83
  Bottom 0.152: R13.2 52.07,47.19 53.34,47.19 53.7,46.83 v53.85,46.83
N$11  (via drill 0.35)
  Top 0.152: U$6.3 40.49,44.56 37.29,41.35 v37.29,40.26 | v41.2,35.36 41.2,33.86 40.64,33.3 U1.6
  Bottom 0.152: v41.2,35.36 41.2,36.2 37.39,40.01 37.39,40.16 v37.29,40.26
N$12
  Top 0.508: CN1.4 8.96,33.05 CN1.5
  Top 0.61: F1.2 11.43,42.7 11.43,33.47 CN1.4
N$13  (via drill 0.35)
  Top 0.508: R23.2 14.32,43.23 v16.08,43.23
  Bottom 0.508: v16.08,43.23 17.37,43.23 U6.7 U6.8 U6.1
N$14  (via drill 0.35)
  Top 0.508: v24.26,43.61 25.61,43.61 L1.P$1 25.86,42.73 D8.C
  Bottom 0.508: v24.26,43.61 23.25,43.61 U6.2
N$15  (via drill 0.35)
  Top 0.508: v24.28,42.29 23.88,42.7 23.24,42.7 22.76,43.18 C15.1
  Bottom 0.508: U6.3 24,42.01 v24.28,42.29
N$16
  Top 0.152: SW1.P$1 58.81,47.37 R17.1
N$17  (via drill 0.35)
  Top 0.508: R21.1 22.25,46.93 R22.2 21.29,46.8 19.48,45 19.48,43.03 v19.56,42.95
  Bottom 0.508: U6.5 17.44,40.77 18.97,40.77 19.53,41.33 19.53,42.93 v19.56,42.95
N$18
  Top 0.152: CN1.YC 16.14,38.38 R20.2
N$19  (via drill 0.35)
  Top 0.152: U$6.1 38.09,43.92 36.58,42.4 36.58,40.23 v36.47,40.13 | v40.06,35.53 40.15,35.45 U1.5
  Bottom 0.152: v36.47,40.13 36.93,39.67 37.03,39.67 39.98,36.73 39.98,35.61 v40.06,35.53
N$21  (via drill 0.35)
  Top 0.152: v46.15,45.71 47.47,45.71 D11.A
  Bottom 0.152: R15.2 45.01,47.64 46.15,46.5 v46.15,45.71
N$22
  Top 0.152: R19.2 17.87,26.26 17.1,25.5 CN1.GC
N$23  (via drill 0.35)
  Top 0.152: 45.95,14.41 RLY-3.6
  Top 0.508: v44.5,12.72 45.95,14.17 45.95,14.41 | RLY-3.6 RLY-3.7
  Bottom 0.508: X3.1 42.51,10.23 D4.C 43.41,11.64 v44.5,12.72
N$24
  Top 0.152: R8.2 51.89,27.04 RLY-3.2
N$26
  Bottom 0.508: RLY-4.6 RLY-4.7 54.8,14.38 D5.C 50.32,9.91 50.32,7.2 X4.1
N$27
  Bottom 0.152: R10.2 58.52,27.09 RLY-4.2
N$29  (via drill 0.35)
  Top 0.508: v62.18,12.39 63.98,14.2 RLY-5.6 RLY-5.7
  Bottom 0.508: X5.1 57.98,9.62 D6.C 60.76,12.39 v62.18,12.39
N$30
  Top 0.152: R12.2 66.52,24.78 RLY-5.2
N$32
  Bottom 0.152: 73.1,14.38 RLY-6.7
  Bottom 0.508: X6.1 65.7,9.49 D7.C 68.56,12.35 71.83,12.35 73.1,13.62 73.1,14.38 | RLY-6.7 RLY-6.6
N$33
  Bottom 0.152: R25.2 75.39,25.77 RLY-6.2
N$38
  Bottom 0.152: CN1.6 14.7,29.36 16.59,29.36 | R4.1 17.63,31.26 16.59,30.21 16.59,29.36 | R18.2 19.75,32.07 16.86,29.18 16.76,29.18 16.59,29.36
SOLV0  (via drill 0.35)
  Top 0.152: U1.21 44,37.88 v43.38,37.26
  Bottom 0.152: 24.53,29.92 22.76,29.92 22.24,30.44 R1.1 | v43.38,37.26 43.38,37.19 43.71,36.85 43.71,33.91 39.8,30 24.6,30 24.53,29.92 | 24.53,29.92 24.49,29.88 25.02,29.88 25.22,29.68 R3.1
SOLV1  (via drill 0.35)
  Top 0.152: R2.1 32.87,28.69 v32.25,29.31 31.62,28.69 R5.1 | v46.43,37.44 46.48,37.49 46.48,37.77 45.87,38.38 U1.22
  Bottom 0.152: v46.43,37.44 44.56,37.44 44.02,36.89 44.02,33.78 39.9,29.67 32.6,29.67 v32.25,29.31
SOLV2  (via drill 0.35)
  Top 0.152: U1.25 43.61,40.9 43.61,40.03 v43.05,39.47
  Bottom 0.152: v41.58,28.77 40.66,27.85 R7.1 | v41.58,28.77 42.04,28.31 R6.1 | v43.05,39.47 43.23,39.29 47.16,39.29 48.11,38.35 48.11,33.47 44.12,29.48 42.29,29.48 v41.58,28.77
SOLV3  (via drill 0.35)
  Top 0.152: R8.1 51.89,29.68 v50.27,31.31 49.43,30.47 R9.1 | v45.64,41.15 44.94,41.85 43.4,41.85 43.14,41.59 U1.26
  Bottom 0.152: v50.27,31.31 50.27,39.99 49.11,41.15 v45.64,41.15
SOLV4  (via drill 0.35)
  Top 0.152: U1.27 42.77,41.05 42.77,41.72 43.31,42.27 44.43,42.27 44.45,42.29 v46.35,42.29
  Bottom 0.152: v46.35,42.29 49.07,42.29 59.88,31.48 59.88,30 | R10.1 59.88,29.31 59.88,30 | R11.1 58.72,28.84 59.88,30
SOLV5  (via drill 0.35)
  Top 0.152: U1.28 42.16,40.95 42.16,41.77 43.22,42.82 v44.2,42.82 | R12.1 68.78,28.8 v67.13,30.45 v67.13,30.44 R24.1
  Bottom 0.152: v44.2,42.82 44.22,42.85 49,42.85 60.63,31.22 66.36,31.22 v67.13,30.45
SOLV6  (via drill 0.35)
  Top 0.152: v41.6,42.75 41.64,42.71 U1.29
  Bottom 0.152: v41.6,42.75 42.24,43.38 49.43,43.38 60.25,32.56 73.41,32.56 75.36,30.61 | 75.36,30.61 75.36,28.66 R25.1 | 75.36,30.61 75.41,30.56 76.81,30.56 77.72,29.64 R26.1
SWCLK  (via drill 0.35)
  Top 0.152: v35.38,39.73 35.46,39.73 35.76,39.42 36.55,39.42 U1.37
  Bottom 0.152: JP2.4 7.09,15.37 7.09,16.77 7.67,17.35 12.43,17.35 17.15,22.07 17.15,24.61 20.17,27.63 26.43,27.63 27.04,28.25 34.47,28.25 35.16,28.93 40.08,28.93 47.39,36.24 47.39,37.74 46.66,38.48 43.23,38.48 42.37,37.62 42.37,36.4 42.82,35.94 42.82,34.06 41.12,32.36 38.02,32.36 36.09,34.29 36.09,36.35 36.12,36.38 36.12,38.63 36.12,38.99 v35.38,39.73
SWDIO  (via drill 0.35)
  Top 0.152: JP2.2 6.88,12.62 6.88,14.43 7.62,15.16 8.97,15.16 15.15,21.35 51.41,21.35 53.28,23.22 53.28,31.18 57.33,35.23 v57.33,36.83 | v41.66,44.02 41.33,44.02 39.14,41.84 U1.34
  Bottom 0.152: v41.66,44.02 42.2,44.56 42.2,46.45 44.11,48.37 48.95,48.37 50.09,47.23 50.09,44.44 57.33,37.2 v57.33,36.83
UART_RX  (via drill 0.35)
  Top 0.152: v35,34.21 32.62,34.21 32.4,34.44 31.66,34.44 29.96,32.74 27.79,32.74 17.96,22.91 5,22.91 4.04,21.95 4.04,20.59 5.54,19.1 JP2.8 | v34.9,36.35 34.93,36.38 U1.43
  Bottom 0.152: v35,34.21 35.1,34.31 35.1,35.84 34.9,36.04 v34.9,36.35
UART_TX  (via drill 0.35)
  Top 0.152: v35,37.21 35.59,37.21 35.92,36.88 U1.42
  Bottom 0.152: JP2.6 7.09,17.91 7.09,19.31 7.67,19.89 9.07,19.89 13.81,24.63 13.81,25.9 14.39,26.48 15.66,26.48 20.72,31.54 20.72,38.83 21.46,39.57 33.58,39.57 35,38.15 v35,37.21
VCC  (via drill 0.35)
  Top 0.508: v16.15,17.25 29.85,17.25 | 29.85,17.25 29.73,17.37 47.91,17.37 | 29.85,17.25 RLY-1.8 | 47.91,17.37 RLY-3.8 | 47.91,17.37 66.07,17.37 RLY-5.8
  Bottom 0.508: 24V.2 14.15,12.41 | 14.15,12.41 RLY-0.8 | 14.15,12.41 14.15,15.47 15.3,16.62 | v16.15,17.25 15.93,17.25 15.3,16.62 | 15.3,16.62 31.95,16.62 | 31.95,16.62 RLY-2.8 | 31.95,16.62 50.11,16.62 | 50.11,16.62 RLY-4.8 | 50.11,16.62 68.29,16.62 RLY-6.8